# EAGLE schematic bbauv_mega (EAGLE 6.4)
Embedded Systems Schematic for Bumblebee AUV
DOC_FIELD: asdasdsad
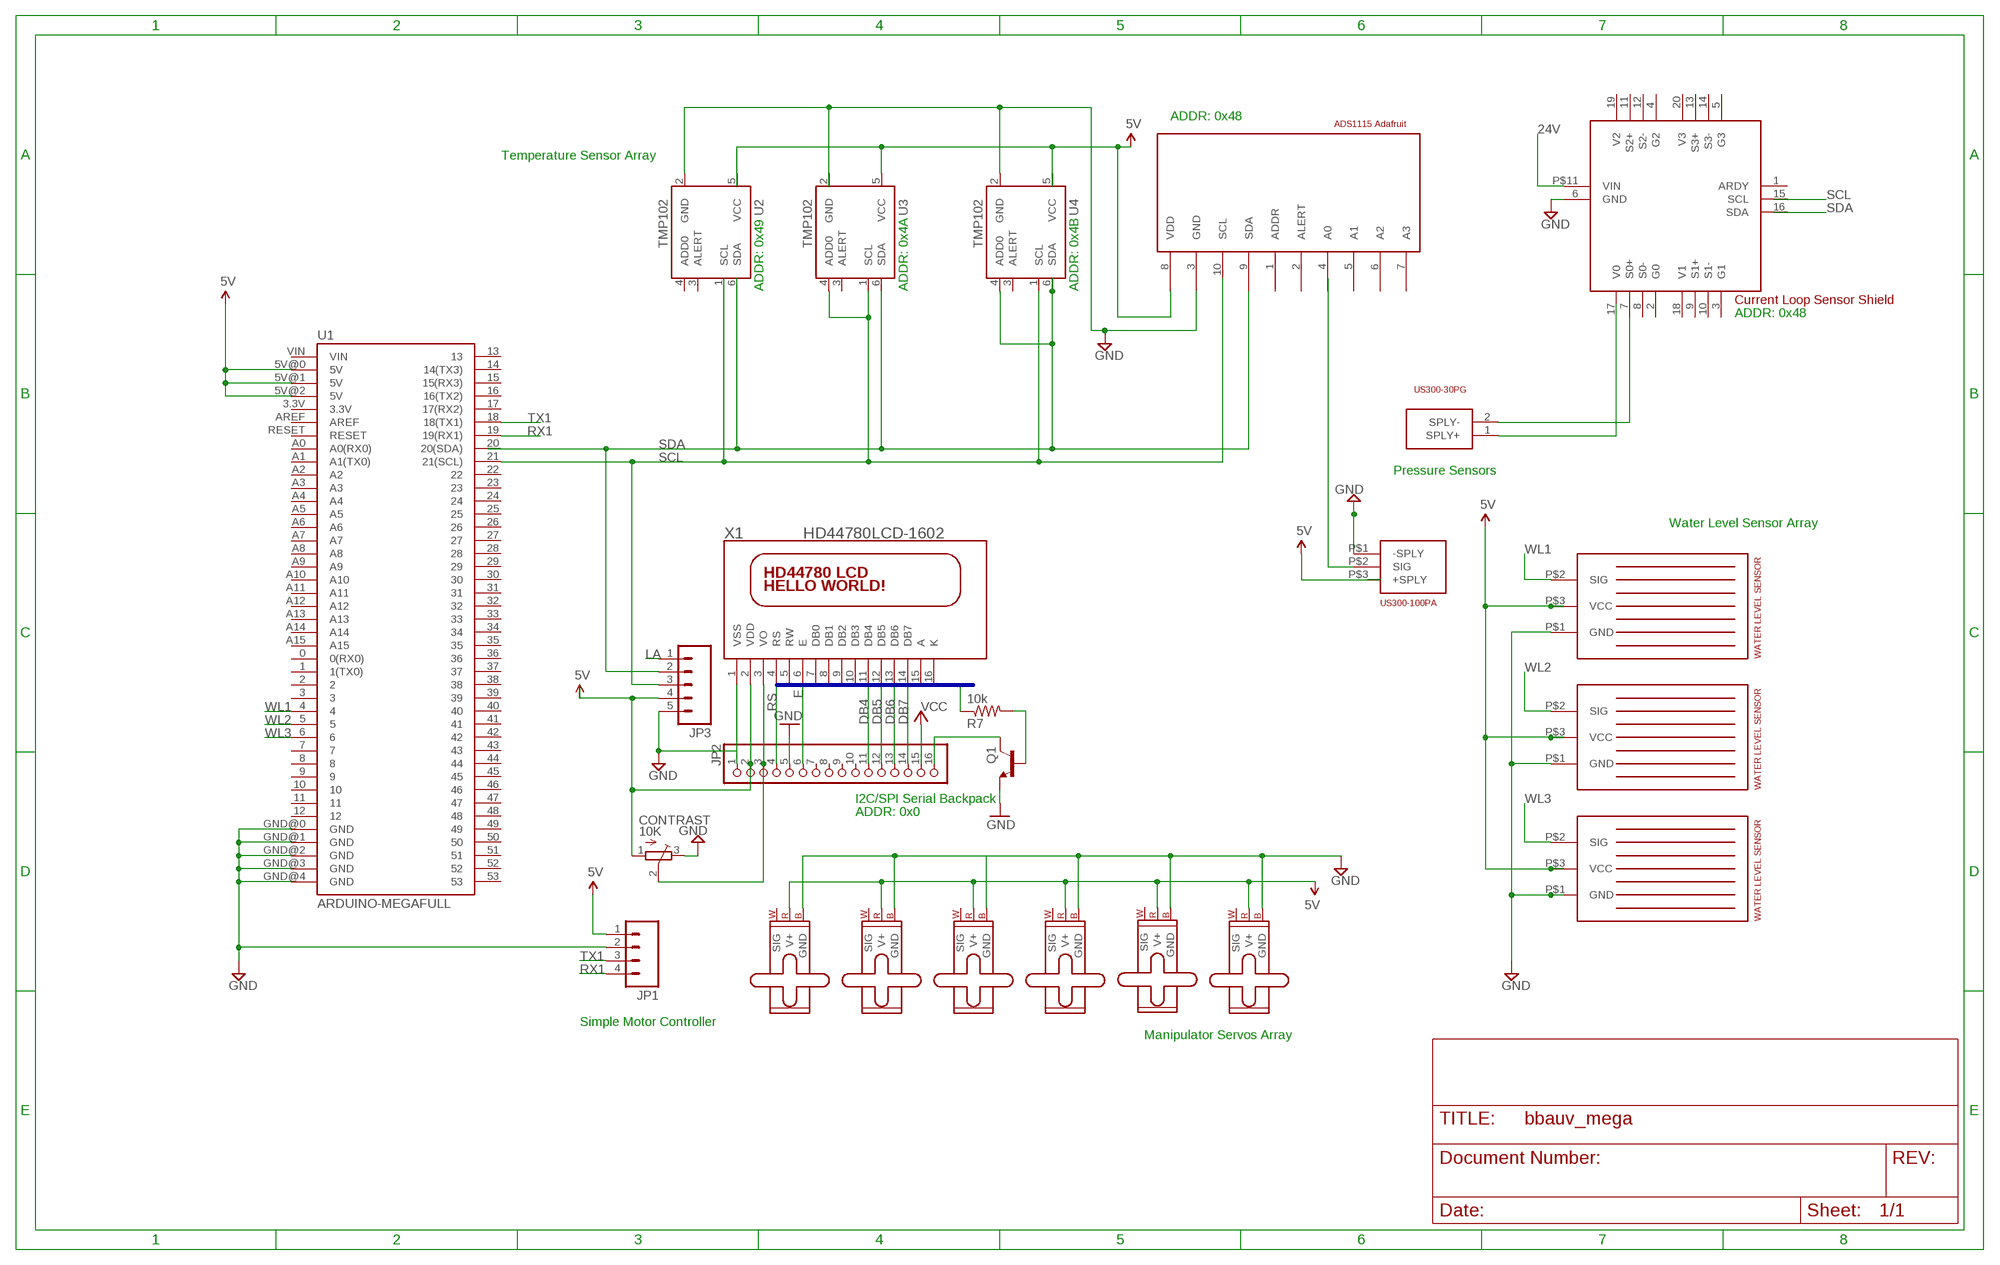
[diagram p0: schematic, sheet 1]

## Parts
CONTRAST  10K  TRIMPOTTC33X  [TC33X]
JP1  M041.27MM  [1X04-1.27MM]
JP2  PINHD-1X16  [1X16]
JP3  M05PTH  [1X05]
M1  SMALL_SERVO  [1X03]
M2  SMALL_SERVO  [1X03]
M3  SMALL_SERVO  [1X03]
M4  SMALL_SERVO  [1X03]
M5  SMALL_SERVO  [1X03]
M6  SMALL_SERVO  [1X03]
Q1  MMBT2222ALT1-NPN-SOT23-BEC  [SOT23-BEC]
R7  10k  R-US_R0805  [R0805]
U1  ARDUINO-MEGAFULL  [ARDUINO_MEGA]
U2  TMP102  [SOT563]
U3  TMP102  [SOT563]
U4  TMP102  [SOT563]
U$1  ADS1115-2  [ADS1115-2]
U$2  US300-30PG  [US300-30PG]
U$3  WATERLEVEL  [WATERLEVEL]
U$4  WATERLEVEL  [WATERLEVEL]
U$5  WATERLEVEL  [WATERLEVEL]
U$6  US300-100PA  [US300-100PA]
U$7  CURRENTLOOP  [CURRENTLOOP]
X1  HD44780LCD-1602  [LCD1602]

## Nets
5V: JP1.1 M1.2(V+) M2.2(V+) M3.2(V+) M4.2(V+) M6.2(V+) U1.5V@0(5V) U1.5V@1(5V) U1.5V@2(5V) U3.5(VCC) U$1.8(VDD) U$3.P$3(VCC) U$4.P$3(VCC) U$5.P$3(VCC)
24V: U$7.P$11(VIN)
DB4: JP2.11 X1.11(DB4)
DB5: JP2.12 X1.12(DB5)
DB6: JP2.13 X1.13(DB6)
DB7: JP2.14 X1.14(DB7)
E: JP2.6 X1.6(E)
GND: CONTRAST.3(E) JP1.2 JP2.5 JP3.5 M1.3(GND) M2.3(GND) M3.3(GND) M4.3(GND) M6.3(GND) Q1.E U1.GND@0(GND) U1.GND@1(GND) U1.GND@2(GND) U1.GND@3(GND) U1.GND@4(GND) U2.2(GND) U4.2(GND) U$1.3(GND) U$3.P$1(GND) U$4.P$1(GND) U$5.P$1(GND) U$6.P$1(-SPLY) U$7.6(GND)
LA: JP3.1
LITE: R7.1
N$1: U$6.P$2(SIG)
N$2: CONTRAST.2(S) JP2.3 X1.3(VO)
N$5: U$2.2(SPLY-) U$7.7(S0+)
N$6: U$2.1(SPLY+)
N$7: JP2.16 Q1.C
N$9: Q1.B R7.2
RS: JP2.4 X1.4(RS)
RX1: JP1.4 U1.19(19(RX1))
SCL: JP3.3 U1.21(21(SCL)) U3.1(SCL) U3.4(ADD0) U4.1(SCL)
SDA: JP3.2 U3.6(SDA) U4.4(ADD0) U4.6(SDA) U$1.9(SDA)
TX1: JP1.3 U1.18(18(TX1))
VCC: JP2.15
VDD: CONTRAST.1(A) JP2.2 JP3.4 X1.2(VDD)
VSS: JP2.1 X1.1(VSS)
WL1: U1.4 U$4.P$2(SIG)
WL2: U1.5 U$5.P$2(SIG)
WL3: U1.6 U$3.P$2(SIG)
Unconnected: JP2.7 JP2.8 JP2.9 JP2.10 M1.1(SIG) M2.1(SIG) M3.1(SIG) M4.1(SIG) M5.1(SIG) M5.2(V+) M5.3(GND) M6.1(SIG) U1.0(0(RX0)) U1.1(1(TX0)) U1.2 U1.3 U1.3.3V U1.7 U1.8 U1.9 U1.10 U1.11 U1.12 U1.13 U1.14(14(TX3)) U1.15(15(RX3)) U1.16(16(TX2)) U1.17(17(RX2)) U1.20(20(SDA)) U1.22 U1.23 U1.24 U1.25 U1.26 U1.27 U1.28 U1.29 U1.30 U1.31 U1.32 U1.33 U1.34 U1.35 U1.36 U1.37 U1.38 U1.39 U1.40 U1.41 U1.42 U1.43 U1.44 U1.45 U1.46 U1.47 U1.48 U1.49 U1.50 U1.51 U1.52 U1.53 U1.A0(A0(RX0)) U1.A1(A1(TX0)) U1.A2 U1.A3 U1.A4 U1.A5 U1.A6 U1.A7 U1.A8 U1.A9 U1.A10 U1.A11 U1.A12 U1.A13 U1.A14 U1.A15 U1.AREF U1.RESET U1.VIN U2.1(SCL) U2.3(ALERT) U2.4(ADD0) U2.5(VCC) U2.6(SDA) U3.2(GND) U3.3(ALERT) U4.3(ALERT) U4.5(VCC) U$1.1(ADDR) U$1.2(ALERT) U$1.4(A0) U$1.5(A1) U$1.6(A2) U$1.7(A3) U$1.10(SCL) U$7.1(ARDY) U$7.2(G0) U$7.3(G1) U$7.4(G2) U$7.5(G3) U$7.8(S0-) U$7.9(S1+) U$7.10(S1-) U$7.11(S2+) U$7.12(S2-) U$7.13(S3+) U$7.14(S3-) U$7.15(SCL) U$7.16(SDA) U$7.17(V0) U$7.18(V1) U$7.19(V2) U$7.20(V3) X1.5(RW) X1.7(DB0) X1.8(DB1) X1.9(DB2) X1.10(DB3) X1.15(A) X1.16(K)

## Buses
RS,E,DB4,DB5,DB6,DB7,LITE

## Notes on the sheet
- ADDR: 0x48
- Temperature Sensor Array
- ADDR: 0x49 | ADDR: 0x4A | ADDR: 0x4B
- ADDR: 0x48
- Pressure Sensors
- Water Level Sensor Array
- I2C/SPI Serial Backpack
- ADDR: 0x0
- Simple Motor Controller
- Manipulator Servos Array

## Power pins joined to a net without a drawn wire
+SPLY: U$6.P$3(+SPLY)

## Library data of the parts
CONTRAST = adafruit:TRIMPOT: SMT trimmer potentiometer part number TC33X http://www.ladyada.net/library/eagle
JP1 = SparkFun-Connectors:M04: Header 4 Standard 4-pin 0.1" header. Use with straight break away headers (SKU : PRT-00116), right angle break away headers (PRT-00553), swiss pins (PRT-00743), machine pins (PRT-00117), and female headers (PRT-00115). Molex polarized connector foot print use with SKU : PRT-08231 with associated crimp pins and housings. 1MM SMD Version SKU: PRT-10208
JP2 = pinhead:PINHD-1X16: PIN HEADER
JP3 = SparkFun-Connectors:M05: Header 5 Standard 5-pin 0.1" header. Use with straight break away headers (SKU : PRT-00116), right angle break away headers (PRT-00553), swiss pins (PRT-00743), machine pins (PRT-00117), and female headers (PRT-00115). Molex polarized connector foot print use with SKU : PRT-08230 with associated crimp pins and housings.
M1-M6 = SparkFun-Electromechanical:SMALL_SERVO: Small servo motor This is the small servo used in the SIK. SKU: ROB-09065
Q1 = transistor:*-NPN-: NPN Transistror BF959 corrected 2008.03.06
R7 = adafruit:R-US_: RESISTOR, American symbol
U1 = SparkFun-Boards:ARDUINO-MEGA: Arduino Mega board footprint
U2-U4 = SparkFun-Sensors:TMP102: I2C degC temp sensor
U$1 = User-defined:ADS1115-2
U$2 = User-defined:US300-30PG: US300 Pressure sensor from Measurement Specialities. 0 - 30PSI Gauge
U$3-U$5 = User-defined:WATERLEVEL
U$6 = User-defined:US300-100PA: US300 Pressure sensor from Measurement Specialities. 0 - 100PSI Absolute
U$7 = User-defined:CURRENTLOOP
X1 = adafruit:HD44780LCD: HD44780 LCD Standard character type LCDs, available in sizes from 8x1 to 40x4!